# Altium schematic sheet led_boost.SchDoc
size 292 x 204 mm; ProjectSection: Set ProjectSection in Document Parameters; PageSetup: Record=PageOptions|CenterHorizontal=True|CenterVertical=True|PrintScale=1.00|XCorrection=1.00|YCorrection=1.00|PrintKind=1|BorderSize=5000000|LeftOffset=0|BottomOffset=0|Orientation=2|PaperLength=1000|PaperWidth=1000|Scale=100|PaperSource=7|PrintQuality=1200|MediaType=1|DitherType=10|PaperKind=A4|PrintScaleMode=1
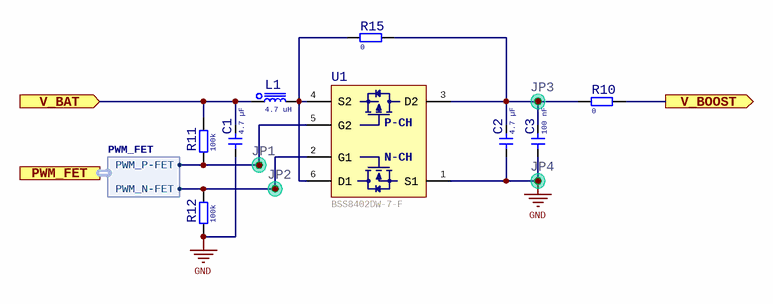
[diagram p0: led_boost.SchDoc]

## Parts
C1  value 4.7 µF  [1608C]  (hidden comment: CAP-NP)
C2  value 4.7 µF  [1608C]  (hidden comment: CAP-NP)
C3  value 100 nF  [1608C]  (hidden comment: CAP-NP)
JP1  CON-01-TESTPOINT  [CON-01-PAD-1.3MM-1MM]  (value not drawn)  (no BOM)
JP2  CON-01-TESTPOINT  [CON-01-PAD-1.3MM-1MM]  (value not drawn)  (no BOM)
JP3  CON-01-TESTPOINT  [CON-01-PAD-1.3MM-1MM]  (value not drawn)  (no BOM)
JP4  CON-01-TESTPOINT  [CON-01-PAD-1.3MM-1MM]  (value not drawn)  (no BOM)
L1  value 4.7 uH  [2012L]  (hidden comment: INDUCTOR)
R10  value 0  [1608R]  (hidden comment: RES)
R11  value 100k  [1608R]  (hidden comment: RES)
R12  value 100k  [1608R]  (hidden comment: RES)
R15  value 0  [1608R]  (hidden comment: RES)
U1  Manufacturer Part Number: BSS8402DW-7-F  [TRANS-DUAL-SOT-363-6]  (hidden comment: TRANS-FET-DUAL-N-P-6PIN)

## Ports
PWM_FET (harness PWM_FET), V_BAT (in), V_BOOST (out)

## Harnesses
PWM_FET: PWM_P-FET, PWM_N-FET

## Nets
GND: C1.1 C2.1 C3.1 JP4.1 R12.1 U1.1(S1)
V_BAT: C1.2 L1.1 R11.2 ; port V_BAT
V_BOOST: R10.2 ; port V_BOOST
NetC2_2: C2.2 C3.2 JP3.1 R10.1 R15.2 U1.3(D2)
NetJP1_1: JP1.1 R11.1 U1.5(G2) ; port PWM_FET.PWM_P-FET
NetJP2_1: JP2.1 R12.2 U1.2(G1) ; port PWM_FET.PWM_N-FET
NetL1_2: L1.2 R15.1 U1.4(S2) U1.6(D1)

## Notes on the sheet
- Project
- Customer
- File Name
- Part
- Section
- Revision (File)
- Variant
- Revision (Project)
- Date
- Sheet
- Contronix GmbH
- Nizzastr. 6, 01445 Radebeul
- (in symbol TRANS-FET-DUAL-N-P-6PIN) P-CH; N-CH

## Library data of the parts
C1 C2 = CAP-4u7-10V-10%-X5R-1608: SMD ceramic capacitor, X5R; Manufacturer: Samsung; Manufacturer P/N: CL10A475KP8NNNC; hasAltManufacturer: 0; Contronix P/N: CKAU8N; autIdem: 255; NozzleType: 711/911; FeederType: Tape 8mm; FeederPitch: 4mm; NumberOfPins: 2; NumberOfRows: 1; Voltage: 10; Tolerance: 10%; PackageCNTX: 1608; CapacitanceSI: 4,7E-6; Design Item Id: CAP-4u7-10V-10%-X5R-1608; Stock: 455; Price: 0,13; Price (€): 0,13; A I: 255; ComponentLink1Description: Manufacturer Datasheet; ComponentLink1URL: http://www.samsungsem.com/kr/support/product-search/mlcc/__icsFiles/afieldfile/2019/05/10/19-CL10A475KP8NNNC.pdf; Supplier 1: Digi-Key; Supplier Part Number 1: 1276-1044-1-ND; Modified: 26.06.2020 15:47:54; Obsolete: 0; Voltage (V): 10; PackageManufacturer: 1608; Material: X5R; MountingType: SMT; polarized: 0; Manufacturer Part Number: CL10A475KP8NNNC
C3 = CAP-100n-16V-10%-X7R-1608: SMD ceramic capacitor; Manufacturer: Samsung; Manufacturer P/N: CL10B104KO8NNNC; hasAltManufacturer: 0; Contronix P/N: C41RLV; autIdem: 255; NozzleType: 701/901; FeederType: Tape 8mm; FeederPitch: 4mm; NumberOfPins: 2; NumberOfRows: 1; Voltage: 16; Tolerance: 10%; PackageCNTX: 1608; CapacitanceSI: 1E-7; Design Item Id: CAP-100n-16V-10%-X7R-1608; Stock: 700; Price: 0,09; Price (€): 0,09; A I: 255; Supplier 1: Digi-Key; Supplier Part Number 1: 1276-1005-1-ND; Modified: 07.07.2020 16:43:22; Obsolete: 0; Voltage (V): 16; PackageManufacturer: 1608; MountingType: SMT; polarized: 0; Manufacturer Part Number: CL10B104KO8NNNC
JP1-JP4 = CON-01-TESTPOINT-1.3MM-1MM: 1.3 mm rund mit 1.0 mm Bohrung; hasAltManufacturer: 0; Contronix P/N: JMZ13D; NumberOfPins: 1; Design Item Id: CON-01-TESTPOINT-1.3MM-1MM; Price: 0; Price (€): 0; autIdem: 0; A I: 0; Created: 04.06.2015 12:33:39; Modified: 04.06.2015 12:33:39; Obsolete: 0; NumberOfRows: 1; MountingType: THT
L1 = IND-4u7-0.8A-2012: Chip Inductor; Manufacturer: Murata Electronics; Manufacturer P/N: LQM21PN4R7NGRD; hasAltManufacturer: 0; Contronix P/N: LD7UG2; NozzleType: 711/911; FeederType: Tape 8mm; FeederPitch: 4mm; NumberOfPins: 2; NumberOfRows: 1; PackageCNTX: 2012; InductanceSI: 4,7E-6; Current: 0,8; Tolerance: 30%; Resistance: 0.288; Design Item Id: IND-4u7-0.8A-2012; Stock: 18; Price: 0,106; Price (€): 0,106; ComponentLink1Description: Manufacturer Datasheet; ComponentLink1URL: http://search.murata.co.jp/Ceramy/image/img/P02/JELF243B-0026.pdf; Supplier 1: Digi-Key; Supplier Part Number 1: 490-7782-1-ND; Supplier 2: Mouser; Supplier Part Number 2: 81-LQM21PN4R7NGRDRD; Created: 09.11.2017 14:17:36; Modified: 14.11.2018 11:06:53; Obsolete: 0; PackageManufacturer: 2012; Inductance: 4.7 uH; MountingType: SMT; Manufacturer Part Number: LQM21PN4R7NGRD
R10 R15 = RES-0R-1%-0.1W-1608: SMD resistor; Manufacturer: Bourns Inc.; Manufacturer P/N: CR0603-J/-000ELF; Contronix P/N: RBXGUK; autIdem: 255; NozzleType: 701/901; FeederType: Tape 8mm; FeederPitch: 4mm; PackageCNTX: 1608; NumberOfPins: 2; NumberOfRows: 1; Power: 0,1; Design Item Id: RES-0R-1%-0.1W-1608; hasAltManufacturer: 0; Stock: 6271; Price: 0,00373; Price (€): 0,00373; A I: 255; Supplier 1: Mouser; Supplier Part Number 1: 652-CR0603-J/-000ELF; Supplier 2: Digi-Key; Supplier Part Number 2: CR0603-J/-000ELFCT-ND; Modified: 16.08.2019 13:28:22; Obsolete: 0; PackageManufacturer: 1608; Resistance: 0; ResistanceSI: 0; MountingType: SMT; Manufacturer Part Number: CR0603-J/-000ELF
R11 R12 = RES-100k-1%-0.1W-1608: SMD resistor; Manufacturer: Panasonic - ECG; Manufacturer P/N: ERJ-2RKF1003X; hasAltManufacturer: 0; Contronix P/N: RBZVDE; autIdem: 255; NozzleType: 711/911; FeederType: Tape 8mm; FeederPitch: 4mm; PackageCNTX: 1608; NumberOfPins: 2; NumberOfRows: 1; ResistanceSI: 100000; Tolerance: 1%; Power: 0,1; Design Item Id: RES-100k-1%-0.1W-1608; Stock: 3994; Price: 0,01; Price (€): 0,01; A I: 255; ComponentLink1Description: Manufacturer Datasheet; ComponentLink1URL: http://www.mouser.com/ds/2/315/AOA0000C86-911473.pdf; Supplier 1: Digi-Key; Supplier Part Number 1: P100KLCT-ND; Supplier 2: Mouser; Supplier Part Number 2: 667-ERJ-2RKF1003X; Modified: 27.07.2018 09:54:07; Obsolete: 0; PackageManufacturer: 1608; Resistance: 100k; MountingType: SMT; Manufacturer Part Number: ERJ-2RKF1003X
U1 = TRANS-FET-DUAL-N-P-6PIN: N and P-Channel MOSFET; Manufacturer: Diodes Inc.; hasAltManufacturer: 0; FeederType: Tape 8mm; FeederPitch: 4mm; Current: 4,7; Design Item Id: TRANS-FET-DUAL-N-P-20V; ComponentLink1Description: Manufacturer Datasheet; ComponentLink1URL: https://www.diodes.com/assets/Datasheets/DMC2041UFDB.pdf; Created: 13.02.2018 12:07:42